# Altium schematic sheet bms_interface.SchDoc: BMS Interface
size A4; Engineer: Shelby Riggleman; Organization: Badgerloop Electrical; Address1: 133 Engineering Research Building; Address2: 1500 Engineering Drive; Address3: Madison, Wi 53706; Revision: A; SheetNumber: 10
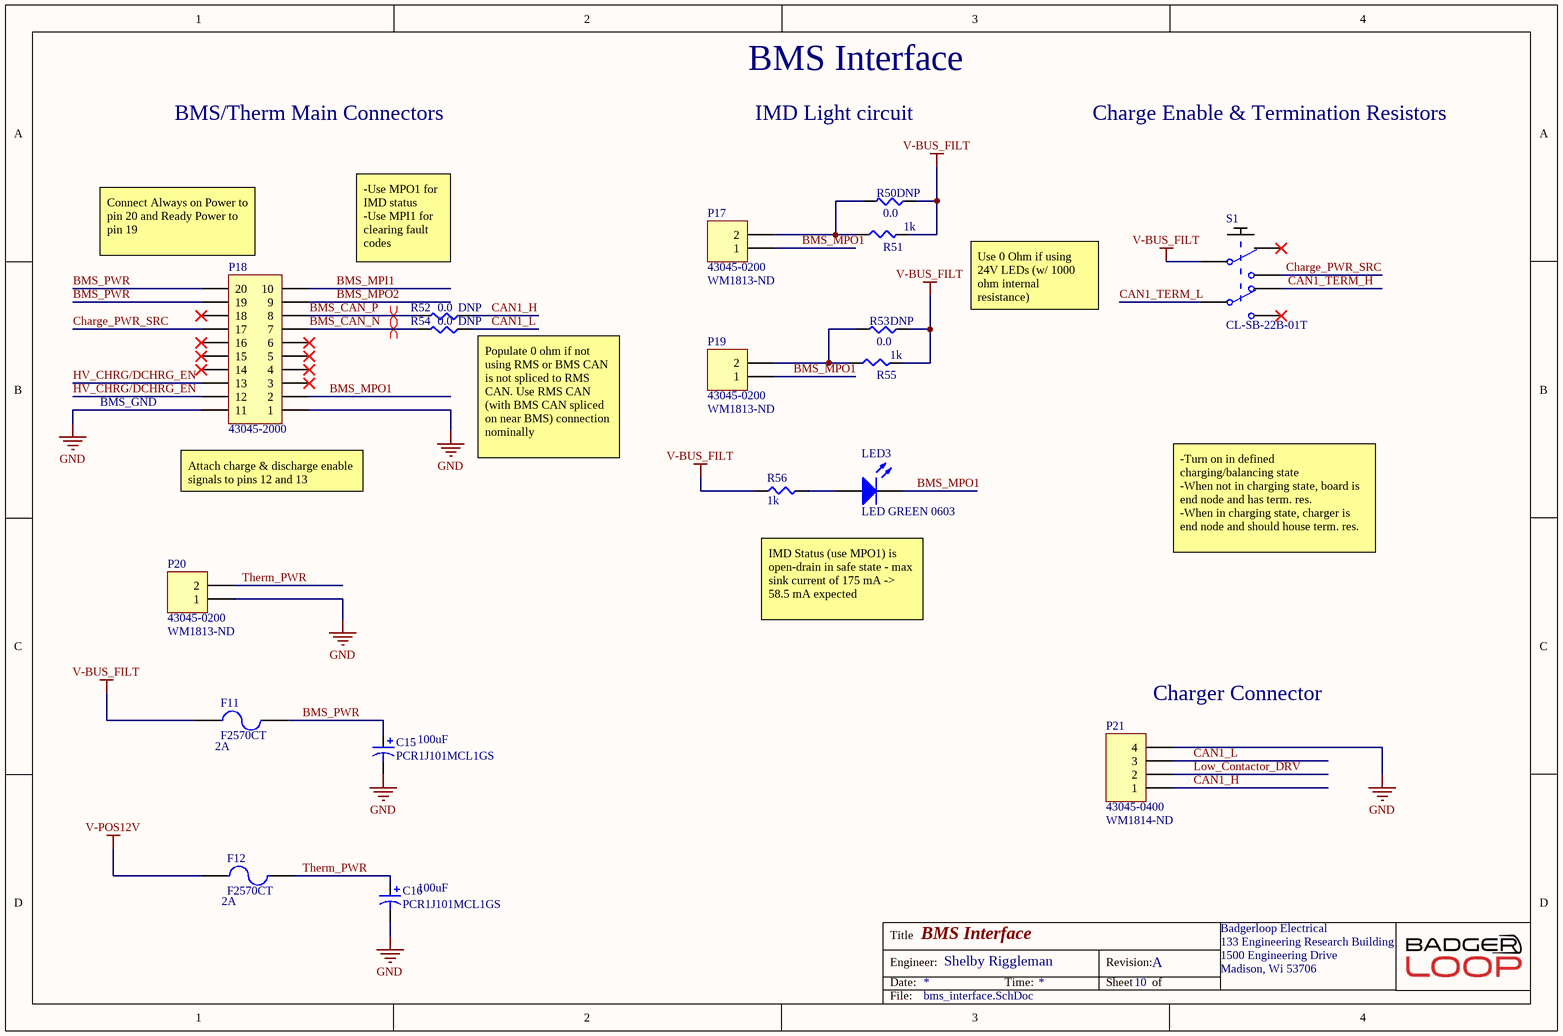
[diagram p0: bms_interface.SchDoc]

## Parts
C15  PCR1J101MCL1GS  Capacitance: 100uF  [CAPAE110103X126M]
C16  PCR1J101MCL1GS  Capacitance: 100uF  [CAPAE110103X126M]
F11  F2570CT  Current Rating: 2A  [SMD-1206-RES]
F12  F2570CT  Current Rating: 2A  [SMD-1206-RES]
LED3  LED GREEN 0603  [LED 0603 GREEN]
P17  43045-0200  Supplier Part Number 1: WM1813-ND  [430450200]
P18  43045-2000  [430452000]
P19  43045-0200  Supplier Part Number 1: WM1813-ND  [430450200]
P20  43045-0200  Supplier Part Number 1: WM1813-ND  [430450200]
P21  43045-0400  Supplier Part Number 1: WM1814-ND  [430450400]
R50  0.0  [SMD-0805-RES]
R51  1k  [SMD-0805-RES]
R52  0.0  [SMD-0805-RES]
R53  0.0  [SMD-0805-RES]
R54  0.0  [SMD-0805-RES]
R55  1k  [SMD-0805-RES]
R56  1k  [SMD-0805-RES]
S1  CL-SB-22B-01T  [SOP250P500X350-6N]

## Nets
GND: C15.2 C16.2 P18.1 P18.11 P20.1 P21.4
V-BUS_FILT: F11.1 R50.1 R51.2 R53.1 R55.2 R56.1 S1.2
V-POS12V: F12.1
BMS_CAN_N: P18.7 R54.2
BMS_CAN_P: P18.8 R52.2
BMS_MPI1: P18.10
BMS_MPO1: LED3.2(K) P17.1 P18.2 P19.1
BMS_MPO2: P18.9
BMS_PWR: C15.1 F11.2 P18.19 P18.20
CAN1_H: P21.1 R52.1
CAN1_L: P21.3 R54.1
CAN1_TERM_H: S1.4
CAN1_TERM_L: S1.5
Charge_PWR_SRC: P18.17 S1.3
HV_CHRG/DCHRG_EN: P18.12 P18.13
Low_Contactor_DRV: P21.2
Therm_PWR: C16.1 F12.2 P20.2
NetLED3_1: LED3.1(A) R56.2
NetP17_2: P17.2 R50.2 R51.1
NetP19_2: P19.2 R53.2 R55.1

Not connected (* = marked no-connect by the designer): P18 3* 4* 5* 6* 14* 15* 16* 18*; S1 1* 6*

## Layout directives
differential pair: BMS_CAN_N, BMS_CAN_P

## Notes on the sheet
- BMS Interface
- BMS/Therm Main Connectors
- IMD Light circuit
- Charge Enable & Termination Resistors
- (near P18) Connect Always on Power to pin 20 and Ready Power to pin 19
- -Use MPO1 for IMD status
  -Use MPI1 for clearing fault codes
- Use 0 Ohm if using 24V LEDs (w/ 1000 ohm internal resistance)
- BMS_GND
- (near P18) Attach charge & discharge enable signals to pins 12 and 13
- Populate 0 ohm if not using RMS or BMS CAN is not spliced to RMS CAN. Use RMS CAN (with BMS CAN spliced on near BMS) connection nominally
- -Turn on in defined charging/balancing state
  -When not in charging state, board is end node and has term. res.
  -When in charging state, charger is end node and should house term. res.
- IMD Status (use MPO1) is open-drain in safe state - max sink current of 175 mA -> 58.5 mA expected
- (near P21) Charger Connector
- Title
- Engineer:
- Date:
- Time:
- Revision:
- Sheet
- of
- File:

## Library data of the parts
C15 C16 = PCR1J101MCL1GS: CAP ALUM POLY 100UF 20% 63V SMD; Manufacturer: Nichicon; ESR (Equivalent Series Resistance): 24mR; Ripple Current: 3A; Leakage Current: 3uA; Life (Hours): 4000Hour; Dissipation Factor: 0.08%; Supplier 1: Digi-Key; Manufacturer Part Number: PCR1J101MCL1GS; Stock 1: 11476; Pricing 1: 1=3.63000, 10=2.92800, 100=2.28380 (USD); RoHS: Yes; Mount: Surface Mount,PCB; Case/Package: Radial; Weight: 0.045856oz; Min Operating Temperature: -55°C; Max Operating Temperature: 125°C; Tolerance: 20%; Voltage Rating (DC): 63V; Package Quantity: 1; Packaging: Tape and Reel; Voltage Rating: 63V; Termination: SMD/SMT; Voltage: 63V; Diameter: 10mm; Length: 12.7mm; Height: 12.7mm; Height - Seated (Max): 0.504inch; Depth: 10.3mm; Lead Pitch: 4.6mm; Lead Free: Lead Free; ComponentLink1URL: https://datasheet.ciiva.com/29551/e-ch-ta-29551389.pdf?src-supplier=Digi-Key; ComponentLink1Description: https://datasheet.ciiva.com/29551/e-ch-ta-29551389.pdf?src-supplier=Digi-Key; ComponentLink2URL: https://datasheet.ciiva.com/29551/e-ch-ta-29551390.pdf?src-supplier=Digi-Key; ComponentLink2Description: https://datasheet.ciiva.com/29551/e-ch-ta-29551390.pdf?src-supplier=Digi-Key; ComponentLink3URL: https://datasheet.ciiva.com/29551/e-ch-ta-29551391.pdf?src-supplier=Digi-Key; ComponentLink3Description: https://datasheet.ciiva.com/29551/e-ch-ta-29551391.pdf?src-supplier=Digi-Key; Supplier Part Number 1: 493-13783-1-ND
F11 F12 = F2570CT: FUSE BOARD MNT 2A 63VAC/VDC 1206; Manufacturer: Littelfuse; Manufacturer Part Number: 0468002.NR; Voltage Rating (AC): 63V; Resistance: 32.4mR; Power Dissipation: 154.5mW; Fuse Type: Board Mount (Cartridge Style Excluded); Approvals: UL,CSA; Supplier 1: Digi-Key; Stock 1: 13091; Pricing 1: 1=1.2, 5=1.166, 10=1.091, 50=0.9028, 100=0.7524, 250=0.7336, 500=0.62074, 1000=0.54549 (USD); Mount: Surface Mount; Case/Package: 1206; Number of Pins: 2; Case Code (Metric): 3216; Case Code (Imperial): 1206; Terminal Material: Tin; Min Operating Temperature: -55°C; Max Operating Temperature: 90°C; Voltage Rating (DC): 63V; Packaging: Tape and Reel; Package Quantity: 5000; Voltage Rating: 63V; Termination: SMD/SMT; Composition: Thin Film; DC Cold Resistance: 32.4mR; Fuse Current: 2A; Length: 3.18mm; Height: 0.58mm; Width: 1.52mm; Depth: 1.52mm; Radiation Hardening: No; REACH SVHC: Unknown; Lead Free: Lead Free; ComponentLink1URL: http://www.farnell.com/datasheets/94905.pdf?src-supplier=Farnell; ComponentLink1Description: http://www.farnell.com/datasheets/94905.pdf?src-supplier=Farnell; ComponentLink2URL: http://www.littelfuse.com/~/media/electronics/datasheets/fuses/littelfuse_fuse_468_datasheet.pdf.pdf?src-supplier=Digi-Key; ComponentLink2Description: http://www.littelfuse.com/~/media/electronics/datasheets/fuses/littelfuse_fuse_468_datasheet.pdf.pdf?src-supplier=Digi-Key; ComponentLink3URL: http://www.farnell.com/datasheets/1851811.pdf?src-supplier=Element14; ComponentLink3Description: http://www.farnell.com/datasheets/1851811.pdf?src-supplier=Element14; ComponentLink4URL: http://www.littelfuse.com/~/media/electronics/datasheets/fuses/littelfuse_fuse_468_datasheet.pdf.pdf?src-supplier=Future+Electronics; ComponentLink4Description: http://www.littelfuse.com/~/media/electronics/datasheets/fuses/littelfuse_fuse_468_datasheet.pdf.pdf?src-supplier=Future+Electronics; Supplier Part Number 1: F2570DKR-ND
LED3 = LED GREEN 0603: Manufacturer: Lite-On Inc.; Manufacturer P/N: LTST-C190KGKT; Digikey P/N: 160-1435-1-ND; Package / Case: 0603; Color: GREEN
P17 P19 P20 = 43045-0200: CONN HEADER R/A 2POS; Manufacturer: Molex; Contact Resistance: 10mR; Number of Contacts: 2; Voltage Rating: 600V; Current Rating: 5A; Gender: Male; Max Voltage Rating (DC): 250.25kV; Voltage Rating (DC): 250V; Insulation Resistance: 1GR; Pitch: 3mm; Glow Wire Compliant: Compliant; Approvals: UL,CSA,TUV; Supplier 1: Digi-Key; Manufacturer Part Number: 43045-0200; Stock 1: 6320; Pricing 1: 1=0.97000, 10=0.84900, 100=0.73280, 500=0.59958, 1000=0.53296, 5000=0.46634, 10000=0.44302 (USD); RoHS: Yes; Mount: Through Hole; Case/Package: SMC; Contact Plating: Tin; Color: Black; Contact Material: Brass,Tin; Housing Color: Black; Housing Material: Thermoplastic; Material: Thermoplastic; Min Operating Temperature: -40°C; Max Operating Temperature: 105°C; Termination: Through Hole; Number of Rows: 2; Orientation: Right Angle; Packaging: Tray; Number of Positions: 2; Package Quantity: 3168; Number of Circuits: 2; Contact Gender: Male; Diameter: 3mm; Row Spacing: 3mm; Radiation Hardening: No; Flammability Rating: UL94 V-0; REACH SVHC: Unknown; Lead Free: Lead Free; Halogen Free: Low Halogen; ComponentLink1URL: https://datasheet.ciiva.com/14155/04402310-14155203.pdf?src-supplier=Distrelec; ComponentLink1Description: https://datasheet.ciiva.com/14155/04402310-14155203.pdf?src-supplier=Distrelec; ComponentLink2URL: https://datasheet.ciiva.com/19454/883270-19454006.pdf?src-supplier=Jameco; ComponentLink2Description: https://datasheet.ciiva.com/19454/883270-19454006.pdf?src-supplier=Jameco; ComponentLink3URL: https://datasheet.ciiva.com/5150/0430450200-pcb-headers-145770-5150407.pdf?src-supplier=Mouser; ComponentLink3Description: https://datasheet.ciiva.com/5150/0430450200-pcb-headers-145770-5150407.pdf?src-supplier=Mouser; ComponentLink4URL: https://datasheet.ciiva.com/11747/0900766b80027348-11747001.pdf?src-supplier=RSComponents; ComponentLink4Description: https://datasheet.ciiva.com/11747/0900766b80027348-11747001.pdf?src-supplier=RSComponents; ComponentLink5URL: https://datasheet.ciiva.com/16656/0430450200-pcb-headers-16656330.pdf?src-supplier=Avnet+Europe; ComponentLink5Description: https://datasheet.ciiva.com/16656/0430450200-pcb-headers-16656330.pdf?src-supplier=Avnet+Europe; ComponentLink6URL: https://datasheet.ciiva.com/10090/0430450200-pcb-headers-10090299.pdf?src-supplier=Avnet; ComponentLink6Description: https://datasheet.ciiva.com/10090/0430450200-pcb-headers-10090299.pdf?src-supplier=Avnet; ComponentLink7URL: https://datasheet.ciiva.com/36854/124280430450200-pcb-headers-36854331.pdf?src-supplier=Onlinecomponents.com; ComponentLink7Description: https://datasheet.ciiva.com/36854/124280430450200-pcb-headers-36854331.pdf?src-supplier=Onlinecomponents.com; ComponentLink8URL: https://datasheet.ciiva.com/1443/1859921-1443437.pdf?src-supplier=Element14; ComponentLink8Description: https://datasheet.ciiva.com/1443/1859921-1443437.pdf?src-supplier=Element14
P18 = 43045-2000: HEADER, RIGHT ANGLE, 20WAY; Manufacturer: Molex; Number of Positions: 20; Contact Resistance: 10mR; Current Rating: 5A; Voltage Rating: 600V; Voltage Rating (AC): 250V; Max Voltage Rating (DC): 250.25kV; Gender: Male; Insulation Resistance: 1GR; Pitch: 3mm; Approvals: UL,CSA,TUV; Glow Wire Compliant: Compliant; Supplier 1: Digi-Key; Manufacturer Part Number: 43045-2000; Stock 1: 1197; Pricing 1: 1=5.17000, 10=4.95900, 100=4.13220, 500=3.51238, 1000=2.99585 (USD); RoHS: Yes; Mount: Through Hole; Contact Plating: Tin; Color: Black; Contact Material: Brass,Tin; Housing Color: Black; Housing Material: Thermoplastic; Material: Polyester; Min Operating Temperature: -40°C; Max Operating Temperature: 105°C; Number of Rows: 2; Termination: Solder; Packaging: Tray; Number of Contacts: 20; Package Quantity: 648; Orientation: Right Angle; Number of Poles: 20; Max Current Rating: 5A; Number of Circuits: 20; Working Voltage: 250V; Voltage Rating (DC): 250V; Operating Supply Voltage: 250V; Length: 34.15mm; Height: 8.77mm; Row Spacing: 3mm; Depth: 12.2mm; Lead Pitch: 3mm; Radiation Hardening: No; Flammability Rating: UL94 V-0; Halogen Free: Low Halogen; Lead Free: Lead Free; ComponentLink1URL: https://datasheet.ciiva.com/5158/0430452000-pcb-headers-143029-5158912.pdf?src-supplier=Mouser; ComponentLink1Description: https://datasheet.ciiva.com/5158/0430452000-pcb-headers-143029-5158912.pdf?src-supplier=Mouser; ComponentLink2URL: https://datasheet.ciiva.com/30232/144790430452000-pcb-headers-30232337.pdf?src-supplier=Onlinecomponents.com; ComponentLink2Description: https://datasheet.ciiva.com/30232/144790430452000-pcb-headers-30232337.pdf?src-supplier=Onlinecomponents.com; ComponentLink3URL: https://datasheet.ciiva.com/11747/0900766b80d6135b-11747452.pdf?src-supplier=RSComponents; ComponentLink3Description: https://datasheet.ciiva.com/11747/0900766b80d6135b-11747452.pdf?src-supplier=RSComponents; ComponentLink4URL: https://datasheet.ciiva.com/19461/800067-19461036.pdf?src-supplier=Jameco; ComponentLink4Description: https://datasheet.ciiva.com/19461/800067-19461036.pdf?src-supplier=Jameco; ComponentLink5URL: https://datasheet.ciiva.com/1443/1786399-1443623.pdf?src-supplier=Element14; ComponentLink5Description: https://datasheet.ciiva.com/1443/1786399-1443623.pdf?src-supplier=Element14; ComponentLink6URL: https://datasheet.ciiva.com/10076/0430452000-pcb-headers-10076859.pdf?src-supplier=Avnet; ComponentLink6Description: https://datasheet.ciiva.com/10076/0430452000-pcb-headers-10076859.pdf?src-supplier=Avnet; ComponentLink7URL: https://datasheet.ciiva.com/14155/04402310-14155212.pdf?src-supplier=Distrelec; ComponentLink7Description: https://datasheet.ciiva.com/14155/04402310-14155212.pdf?src-supplier=Distrelec; Supplier Part Number 1: WM4726-ND
P21 = 43045-0400: Male connector dual row 90° 3 mm Pole no. 2x2 Micro-Fit, 43045-0400, Molex; Contact Resistance: 10mR; Number of Contacts: 4; Max Voltage Rating (AC): 250V; Connector Type: Male Pin; Pitch: 3mm; Row Spacing: 0.118inch; Supplier 1: Digi-Key; Manufacturer: Molex; Manufacturer Part Number: 43045-0400; Stock 1: 5904; Pricing 1: 1=1.33000, 10=1.16700, 100=1.00670, 500=0.82368, 1000=0.73216, 5000=0.64064, 10000=0.60861 (USD); RoHS: Yes; Mount: Through Hole; Contact Plating: Tin; Color: Black; Contact Material: Brass; Housing Color: Black; Housing Material: Polymer; Min Operating Temperature: -40°C; Max Operating Temperature: 105°C; Number of Rows: 2; Termination: Solder; Packaging: Tray; Fastening Type: Ramp; Number of Positions: 4; Orientation: Right Angle; Length: 10.15mm; Depth: 12.2mm; Flammability Rating: UL94 V-0; ComponentLink1URL: https://datasheet.ciiva.com/712/430450200-sd-712017.pdf?src-supplier=Digi-Key; ComponentLink1Description: https://datasheet.ciiva.com/712/430450200-sd-712017.pdf?src-supplier=Digi-Key; ComponentLink2URL: https://datasheet.ciiva.com/20209/22-3744e-20209522.pdf?src-supplier=Rapid+Electronics; ComponentLink2Description: https://datasheet.ciiva.com/20209/22-3744e-20209522.pdf?src-supplier=Rapid+Electronics; ComponentLink3URL: https://datasheet.ciiva.com/11746/0900766b80027348-11746988.pdf?src-supplier=RSComponents; ComponentLink3Description: https://datasheet.ciiva.com/11746/0900766b80027348-11746988.pdf?src-supplier=RSComponents; ComponentLink4URL: https://datasheet.ciiva.com/30193/145420430450400-pcb-headers-30193310.pdf?src-supplier=Onlinecomponents.com; ComponentLink4Description: https://datasheet.ciiva.com/30193/145420430450400-pcb-headers-30193310.pdf?src-supplier=Onlinecomponents.com
R50 R52-R54 = ERJ-6GEY0R00V: RES SMD 0.0 OHM JUMPER 1/8W 0805; Manufacturer: Panasonic Electronic Components; Factory Stock: 0; Unit Price (USD): 0.00544; @ qty: 1500; Minimum Quantity: 1; Power (Watts): 0.125W, 1/8W; Part Number: ERJ-6GEY0R00V; Datasheets: http://industrial.panasonic.com/www-cgi/jvcr13pz.cgi?E+PZ+3+AOA0001+ERJ6GEY0R00V+7+WW; Image: //media.digikey.com/Renders/Panasonic%20Renders/ERJ-0805%20Pkg.jpg; Digi-Key Part Number: P0.0ACT-ND; Quantity Available: 1597627; Packaging: Cut Tape (CT); Series: ERJ; Part Status: Active; Value: 0.0; Tolerance: Jumper; Composition: Thick Film; Features: Automotive AEC-Q200; Temperature Coefficient: -; Operating Temperature: -55°C ~ 155°C; Package / Case: 0805 (2012 Metric); Supplier Device Package: 0805; Size / Dimension: 0.079" L x 0.049" W (2.00mm x 1.25mm); Height - Seated (Max): 0.028" (0.70mm); Number of Terminations: 2; Failure Rate: -; DNP: DNP
R51 R55 R56 = ERJ-P06J102V: RES SMD 1K OHM 5% 1/2W 0805; Manufacturer: Panasonic Electronic Components; Factory Stock: 0; Unit Price (USD): 0.01839; @ qty: 1500; Minimum Quantity: 1; Power (Watts): 0.5W, 1/2W; Temperature Coefficient: ±200ppm/°C; Part Number: ERJ-P06J102V; Datasheets: https://industrial.panasonic.com/cdbs/www-data/pdf/RDA0000/AOA0000C243.pdf; Image: //media.digikey.com/Renders/Panasonic%20Renders/ERJ-0805%20Pkg.jpg; Digi-Key Part Number: P1.0KADCT-ND; Quantity Available: 124757; Packaging: Cut Tape (CT); Series: ERJ; Part Status: Active; Value: 1k; Tolerance: ±5%; Composition: Thick Film; Features: Automotive AEC-Q200, Pulse Withstanding; Operating Temperature: -55°C ~ 155°C; Package / Case: 0805 (2012 Metric); Supplier Device Package: 0805; Size / Dimension: 0.079" L x 0.049" W (2.00mm x 1.25mm); Height - Seated (Max): 0.028" (0.70mm); Number of Terminations: 2; Failure Rate: -
S1 = CL-SB-22B-01T: SWITCH SLIDE DPDT 200MA 12V; Manufacturer: Nidec Copal; Actuator Material: Nylon,Polyamide; Contact Style: Non-Shorting; Electrical Life: 10000Cycles; Switch Travel: 2mm; Switch Function: On-On; Actuator Type: Standard; Operating Force: 153gf; Supplier 1: Digi-Key; Stock 1: 3664; Pricing 1: 1=1.02, 10=0.979, 25=0.9592, 50=0.857, 100=0.8162, 250=0.79584 (USD); Mount: Surface Mount; Contact Material: Copper; Contact Plating: Silver; Min Operating Temperature: -40°C; Max Operating Temperature: 85°C; Packaging: Tape and Reel; Current Rating: 200mA; Voltage Rating (DC): 12V; Throw Configuration: DPDT; Termination: Gull Wing; Actuator Length: 2mm; Lead Free: Lead Free; ComponentLink1URL: https://www.nidec-copal-electronics.com/e/catalog/switch/cl-sb.pdf?src-supplier=Digi-Key; ComponentLink1Description: https://www.nidec-copal-electronics.com/e/catalog/switch/cl-sb.pdf?src-supplier=Digi-Key; Supplier Part Number 1: 563-1342-6-ND